# EAGLE design C1G14-BreakoutSMT (EAGLE 9.6.2)
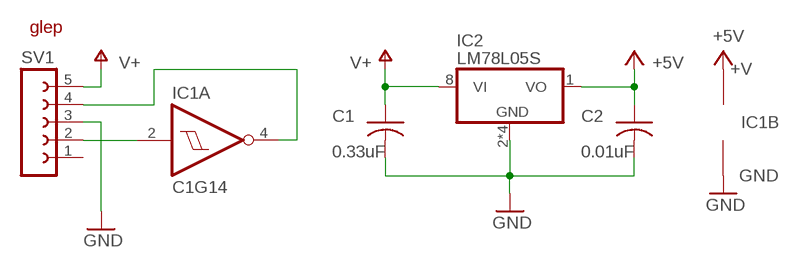
[diagram p0: schematic, sheet 1]

## Parts
C1  0.33uF  C-USC0805  [C0805]
C2  0.01uF  C-USC0805  [C0805]
IC1  C1G14  [SOT-25]
IC2  LM78L05S  [SO08]
SV1  FE05-1  [FE05-1]
U$1  GLEP  [GLEP]

## Nets
+5V: C2.1 IC1.5(B:V+) IC2.1(VO)
GND: C1.2 C2.2 IC1.3(B:GND) IC2.2(GND) IC2.3(GND) IC2.6(GND) IC2.7(GND) SV1.3
N$1: IC1.2(A:A) SV1.2
N$2: IC1.4(A:Y) SV1.4
V+: C1.1 IC2.8(VI) SV1.5
Unconnected: SV1.1

## Library data of the parts
C1 C2 = rcl:C-US: CAPACITOR, American symbol; SPICEPREFIX: C
IC1 = wb-logic:C1G14
IC2 = wb-power:LM78L05
SV1 = con-lsta:FE05-1: FEMALE HEADER; OC_FARNELL: unknown; OC_NEWARK: unknown
U$1 = wb-art:GLEP

## Board
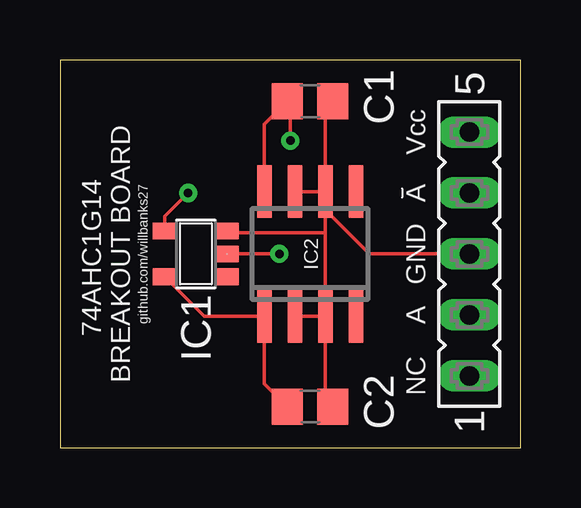
[diagram p1: board, top side]
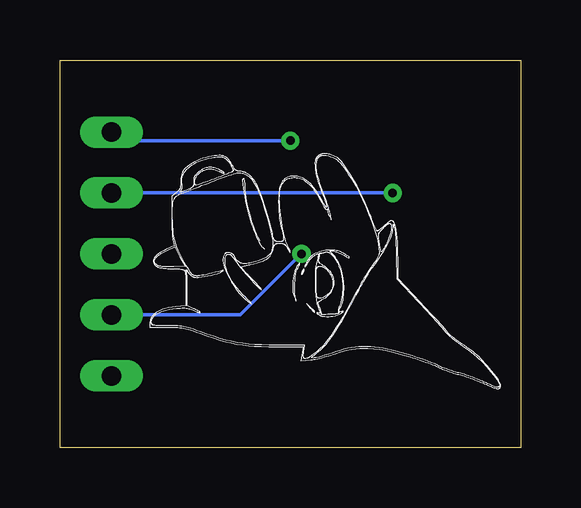
[diagram p2: board, bottom side, seen from below]

Size 19.2 x 16.16 mm. Coordinates in mm from the lower left corner, seen from the top.
Outline: 0,0 19.2,0 19.2,16.16 0,16.16 0,0
Copper layers (1*16): Top 0.035mm / dielectric 1.5mm / Bottom 0.035mm
Design rules "default": minimum track width 6mil, minimum drill 0.35mm, track to track 6mil, track to pad 6mil, pad to pad 6mil, via to via 6mil, smd to smd 6mil, copper to edge 40mil, drill to drill 6mil, minimum pad ring 10mil, minimum via ring 8mil, stop-mask expansion 4mil, vias tented up to drill 0mil, thermal gap 10mil

### Footprints (pad centres in the part's own frame; a part is rotated, then mirrored left to right if it is on the bottom)
C0805 = smd 1.3 x 1.5: 1 -0.95,0; 2 0.95,0
SOT-25 = smd 0.69 x 0.99: 1 -0.95,-1.29; 2 0,-1.29; 3 0.95,-1.29; 4 0.95,1.3; 5 -0.95,1.3
SO08 = smd 0.6 x 2.2: 1 -1.905,-2.6; 2 -0.635,-2.6; 3 0.635,-2.6; 4 1.905,-2.6; 5 1.905,2.6; 6 0.635,2.6; 7 -0.635,2.6; 8 -1.905,2.6
FE05-1 = drill 0.813 long: 1 -5.08,0; 2 -2.54,0; 3 0,0; 4 2.54,0; 5 5.08,0

### Placement (x,y rotation side)
C1  10.42,14.44 0 top
C2  10.42,1.72 0 top
IC1  5.66,8.08 90 top
IC2  10.42,8.08 0 top
SV1  17.06,8.08 90 top
U$1  10.48,6.76 270 bottom

### Tracks (layer width: path | path; a pad name or v marks a point on that pad's centre or on a via)
+5V
  Top 0.152: C2.1 8.52,2.67 IC2.1 6.01,5.48 IC1.5
GND
  Top 0.152: IC2.2 IC2.3 | IC2.7 IC2.6 | IC2.6 11.05,9.92 | 11.05,9.92 11.05,8.96 | 11.05,8.96 IC2.3 | C2.2 11.05,2.04 IC2.3 | C1.2 11.05,14.12 IC2.6 | SV1.3 12.89,8.08 11.05,9.92 | IC1.3 7.02,8.96 11.05,8.96
N$1  (via drill 0.35)
  Top 0.152: IC1.2 v9.14,8.08
  Bottom 0.152: 17.06,5.56 SV1.2 11.68,5.54 v9.14,8.08
N$2  (via drill 0.35)
  Top 0.152: IC1.4 4.36,9.64 v5.34,10.62
  Bottom 0.152: v5.34,10.62 SV1.4
V+  (via drill 0.35)
  Top 0.152: IC2.8 8.52,13.48 C1.1 9.6,14.31 v9.6,12.8
  Bottom 0.152: v9.6,12.8 16.7,12.8 SV1.5

### Text on the board
tPlace: Vcc | A | 74AHC1G14 / BREAKOUT BOARD | github.com/willbanks27 | GND | A | NC